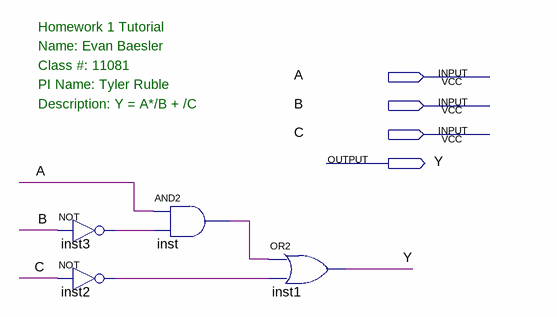
[diagram p0: schematic sheet]
// Quartus schematic hw1_tutorial.bdf as structural Verilog: 4 symbols, 4 pins
module hw1_tutorial (
  input  A,
  input  B,
  input  C,
  output Y
);

  wire inst2_out, inst3_out, inst_out;

  not inst3 (inst3_out, B);
  not inst2 (inst2_out, C);
  and inst (inst_out, A, inst3_out);
  or inst1 (Y, inst_out, inst2_out);

  // Notes on the sheet:
  //   Homework 1 Tutorial
  //   Name: Evan Baesler
  //   Class #: 11081
  //   PI Name: Tyler Ruble
  //   Description: Y = A*/B + /C
endmodule
